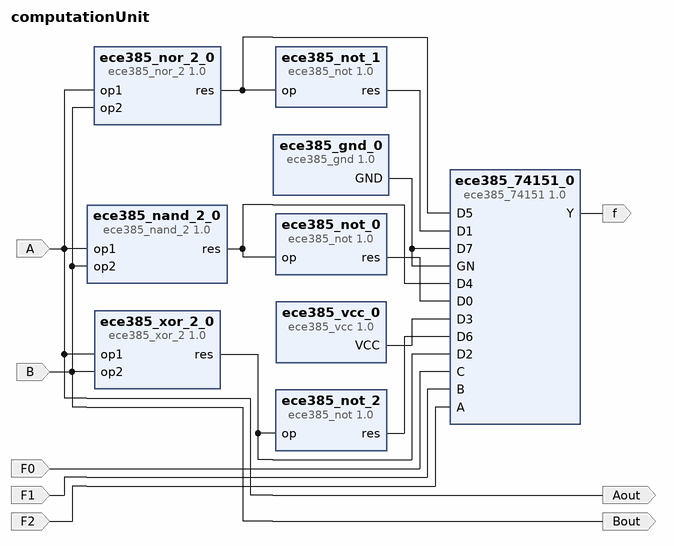
[diagram p0: block diagram of the top level]
# Vivado block design computationUnit, xc7s50csga324-1, Vivado 2022.2
create_bd_design computationUnit

create_bd_port -dir I F2
create_bd_port -dir I F1
create_bd_port -dir I F0
create_bd_port -dir I A
create_bd_port -dir I B
create_bd_port -dir O f
create_bd_port -dir O Aout
create_bd_port -dir O Bout

create_bd_cell -type ip -vlnv ece.illinois.edu:user:ece385_74151:1.0 ece385_74151_0
create_bd_cell -type ip -vlnv ece.illinois.edu:ece385:ece385_nand_2:1.0 ece385_nand_2_0
create_bd_cell -type ip -vlnv ece.illinois.edu:ece385:ece385_not:1.0 ece385_not_0
create_bd_cell -type ip -vlnv ece.illinois.edu:ece385:ece385_nor_2:1.0 ece385_nor_2_0
create_bd_cell -type ip -vlnv ece.illinois.edu:ece385:ece385_not:1.0 ece385_not_1
create_bd_cell -type ip -vlnv ece.illinois.edu:ece385:ece385_xor_2:1.0 ece385_xor_2_0
create_bd_cell -type ip -vlnv ece.illinois.edu:ece385:ece385_not:1.0 ece385_not_2
create_bd_cell -type ip -vlnv ece.illinois.edu:ece385:ece385_vcc:1.0 ece385_vcc_0
create_bd_cell -type ip -vlnv ece.illinois.edu:ece385:ece385_gnd:1.0 ece385_gnd_0

# ---- connections ----

connect_bd_net [get_bd_ports A] \
  [get_bd_pins ece385_nand_2_0/op1] [get_bd_pins ece385_xor_2_0/op1] [get_bd_pins ece385_nor_2_0/op1] [get_bd_ports Aout]
connect_bd_net [get_bd_ports B] \
  [get_bd_pins ece385_nand_2_0/op2] [get_bd_pins ece385_xor_2_0/op2] [get_bd_pins ece385_nor_2_0/op2] [get_bd_ports Bout]
connect_bd_net -net F0_1 [get_bd_ports F0] [get_bd_pins ece385_74151_0/C]
connect_bd_net -net F1_1 [get_bd_ports F1] [get_bd_pins ece385_74151_0/B]
connect_bd_net -net F2_1 [get_bd_ports F2] [get_bd_pins ece385_74151_0/A]
connect_bd_net [get_bd_pins ece385_74151_0/Y] [get_bd_ports f]
connect_bd_net [get_bd_pins ece385_gnd_0/GND] [get_bd_pins ece385_74151_0/D7] [get_bd_pins ece385_74151_0/GN]
connect_bd_net [get_bd_pins ece385_nand_2_0/res] [get_bd_pins ece385_74151_0/D4] [get_bd_pins ece385_not_0/op]
connect_bd_net [get_bd_pins ece385_nor_2_0/res] [get_bd_pins ece385_74151_0/D5] [get_bd_pins ece385_not_1/op]
connect_bd_net [get_bd_pins ece385_not_0/res] [get_bd_pins ece385_74151_0/D0]
connect_bd_net [get_bd_pins ece385_not_1/res] [get_bd_pins ece385_74151_0/D1]
connect_bd_net [get_bd_pins ece385_not_2/res] [get_bd_pins ece385_74151_0/D6]
connect_bd_net [get_bd_pins ece385_vcc_0/VCC] [get_bd_pins ece385_74151_0/D3]
connect_bd_net [get_bd_pins ece385_xor_2_0/res] [get_bd_pins ece385_74151_0/D2] [get_bd_pins ece385_not_2/op]

validate_bd_design
save_bd_design
